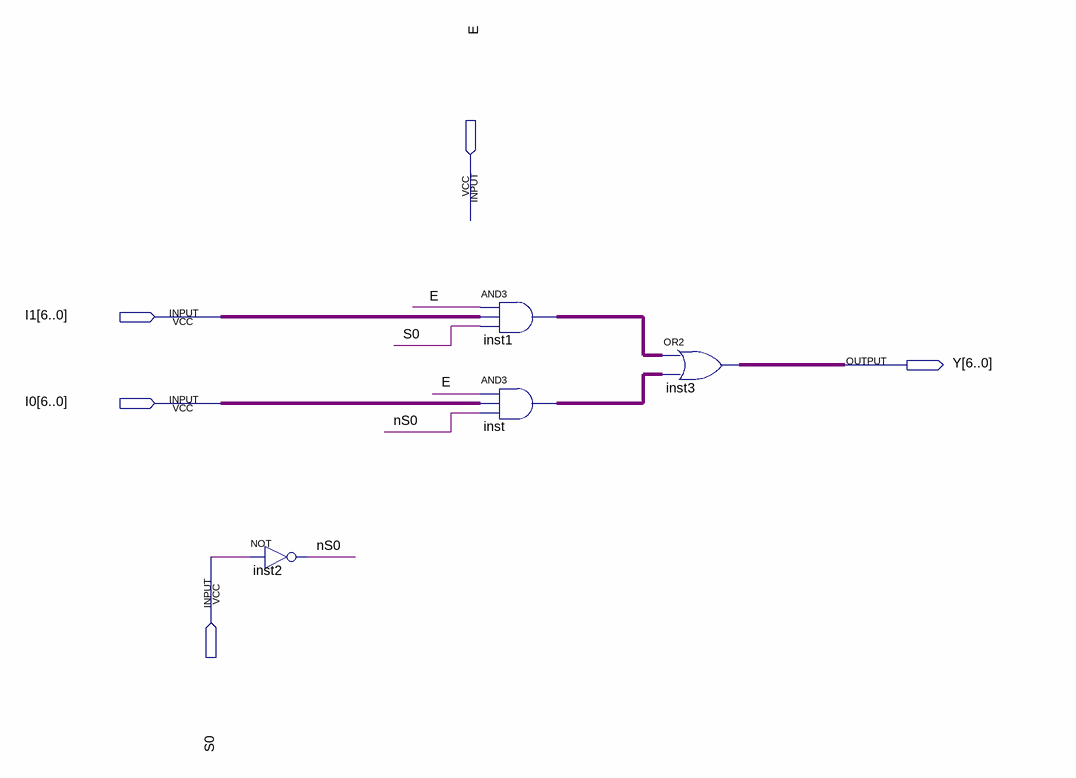
[diagram p0: schematic sheet]
// Quartus schematic MojMX2_1.bdf as structural Verilog: 4 symbols, 5 pins
module MojMX2_1 (
  input  E,
  input  [6:0] I1,
  input  [6:0] I0,
  input  S0,
  output [6:0] Y
);

  wire nS0;
  wire [6:0] inst1_out, inst_out;

  not inst2 (nS0, S0);
  assign inst1_out = {7{E}} & I1 & {7{S0}};  // AND3 inst1, 7 bits wide
  assign inst_out = {7{E}} & I0 & {7{nS0}};  // AND3 inst, 7 bits wide
  assign Y = inst1_out | inst_out;  // OR2 inst3, 7 bits wide
endmodule
